# Altium schematic sheet J-Flash.SchDoc: =ProjectDescription
size 420 x 297 mm; Address1: Address1; Address2: Address2; Address3: Address3; Address4: Address4; SheetNumber: 4; SheetTotal: 3; Scale: 1:1; DocumentType: Схема электрическая принципиальная
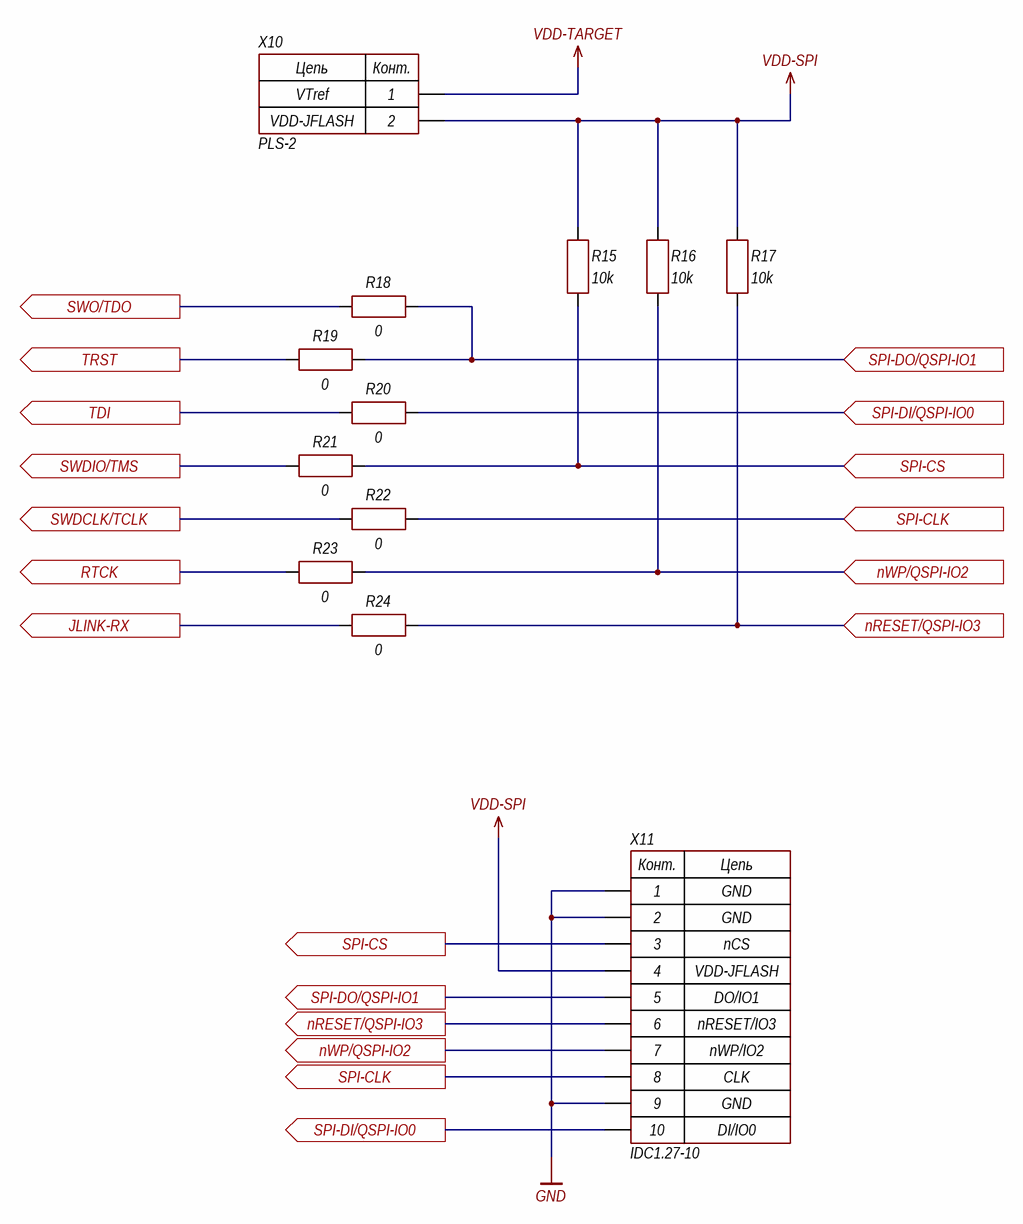
[diagram p0: J-Flash.SchDoc]

## Parts
R15  10k  [CH0402R]
R16  10k  [CH0402R]
R17  10k  [CH0402R]
R18  0  [CH0402R]
R19  0  [CH0402R]
R20  0  [CH0402R]
R21  0  [CH0402R]
R22  0  [CH0402R]
R23  0  [CH0402R]
R24  0  [CH0402R]
X10  PLS-2  [CON: PLS-2]
X11  IDC1.27-10  [CON: IDC1.27-10]

## Ports
JLINK-RX (out), nRESET/QSPI-IO3 (in), nRESET/QSPI-IO3 (out), nWP/QSPI-IO2 (in), nWP/QSPI-IO2 (out), RTCK (out), SPI-CLK (in), SPI-CLK (out), SPI-CS (in), SPI-CS (out), SPI-DI/QSPI-IO0 (in), SPI-DI/QSPI-IO0 (out), SPI-DO/QSPI-IO1 (in), SPI-DO/QSPI-IO1 (out), SWDCLK/TCLK (out), SWDIO/TMS (out), SWO/TDO (out), TDI (out), TRST (out)

## Nets
GND: X11.1 X11.2 X11.9
VDD-SPI: R15.2 R16.2 R17.2 X10.2 X11.4
VDD-TARGET: X10.1
JLINK-RX: R24.1 ; port JLINK-RX
nRESET/QSPI-IO3: R17.1 R24.2 X11.6 ; port nRESET/QSPI-IO3
nWP/QSPI-IO2: R16.1 R23.2 X11.7 ; port nWP/QSPI-IO2
RTCK: R23.1 ; port RTCK
SPI-CLK: R22.2 X11.8 ; port SPI-CLK
SPI-CS: R15.1 R21.2 X11.3 ; port SPI-CS
SPI-DI/QSPI-IO0: R20.2 X11.10 ; port SPI-DI/QSPI-IO0
SPI-DO/QSPI-IO1: R18.2 R19.2 X11.5 ; port SPI-DO/QSPI-IO1
SWDCLK/TCLK: R22.1 ; port SWDCLK/TCLK
SWDIO/TMS: R21.1 ; port SWDIO/TMS
SWO/TDO: R18.1 ; port SWO/TDO
TDI: R20.1 ; port TDI
TRST: R19.1 ; port TRST

## Notes on the sheet
- VTref
- VDD-JFLASH
- GND
- nCS
- nWP/IO2
- nRESET/IO3
- DO/IO1
- DI/IO0
- CLK
- Изм.
- Лист
- № докум.
- Подп.
- Дата
- 2.106-A3
- Копировал
- Формат А3
- (in symbol 2-Connector) Цепь; Конт.
- (in symbol 10-Connector) Конт.; Цепь

## Library data of the parts
R15-R24 = Resistor: Manufacturer: *; Model: *; HelpURL: *; ComponentKind: *; ClassName: J-FLASH
  R15-R17: Value: 10k
  R18-R24: Value: 0
X10 = 2-Connector: Model: PLS-2; Manufacturer: *; HelpURL: *; ComponentKind: *; ClassName: J-FLASH
X11 = 10-Connector: Model: IDC1.27-10; Manufacturer: *; HelpURL: *; ComponentKind: *; ClassName: J-FLASH